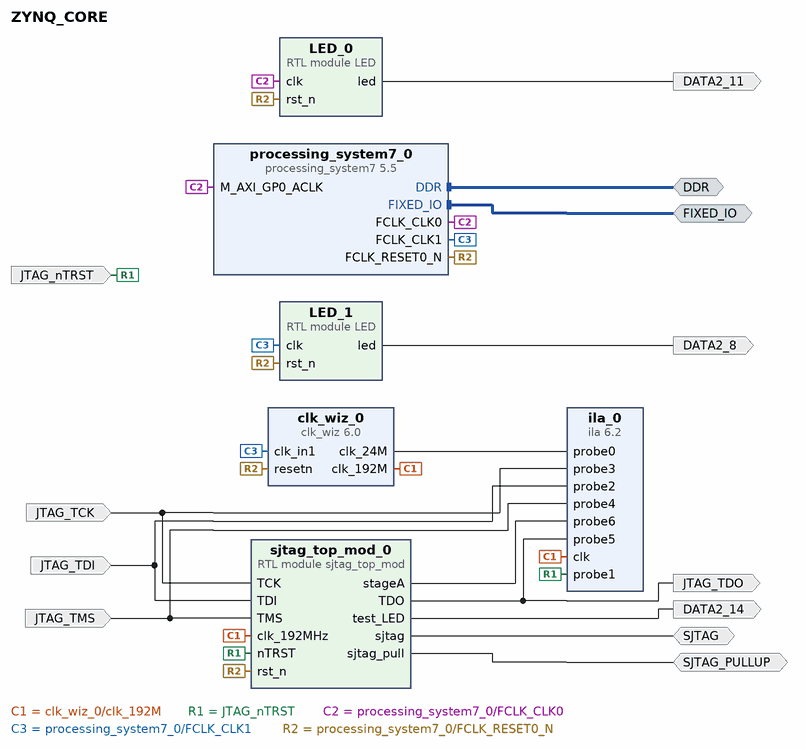
[diagram p0: block diagram of the top level]
# Vivado block design ZYNQ_CORE, xc7z010clg400-1, Vivado 2021.2
create_bd_design ZYNQ_CORE

create_bd_intf_port -mode Master -vlnv xilinx.com:interface:ddrx_rtl:1.0 DDR
create_bd_intf_port -mode Master -vlnv xilinx.com:display_processing_system7:fixedio_rtl:1.0 FIXED_IO
create_bd_port -dir I JTAG_nTRST
create_bd_port -dir I JTAG_TDI
create_bd_port -dir I JTAG_TCK
create_bd_port -dir I JTAG_TMS
create_bd_port -dir O JTAG_TDO
create_bd_port -dir O DATA2_8
create_bd_port -dir O DATA2_11
create_bd_port -dir O DATA2_14
create_bd_port -dir IO SJTAG
create_bd_port -dir IO SJTAG_PULLUP

create_bd_cell -type ip -vlnv xilinx.com:ip:processing_system7:5.5 processing_system7_0
set_property -dict [list \
  CONFIG.PCW_EN_CLK1_PORT 1 \
  CONFIG.PCW_FCLK_CLK1_BUF TRUE \
  CONFIG.PCW_FPGA0_PERIPHERAL_FREQMHZ 50 \
  CONFIG.PCW_FPGA1_PERIPHERAL_FREQMHZ 48 \
  CONFIG.PCW_FPGA_FCLK1_ENABLE 1 \
  CONFIG.PCW_SD0_GRP_CD_ENABLE 1 \
  CONFIG.PCW_SD0_GRP_CD_IO {MIO 34} \
  CONFIG.PCW_SD0_GRP_WP_ENABLE 0 \
  CONFIG.PCW_SD0_PERIPHERAL_ENABLE 1 \
  CONFIG.PCW_SD0_SD0_IO {MIO 40 .. 45} \
  CONFIG.PCW_SDIO_PERIPHERAL_FREQMHZ 100 \
  CONFIG.PCW_UART1_PERIPHERAL_ENABLE 1 \
  CONFIG.PCW_UART1_UART1_IO {MIO 24 .. 25} \
  CONFIG.PCW_UART_PERIPHERAL_FREQMHZ 100 \
  CONFIG.PCW_UIPARAM_DDR_BUS_WIDTH {16 Bit} \
  CONFIG.PCW_UIPARAM_DDR_PARTNO {MT41K128M16 JT-125} \
] [get_bd_cells processing_system7_0]
# 70 more settings of processing_system7_0 are not shown: defaults, MIO pin electricals, DDR timing, and values the tool derives
create_bd_cell -type ip -vlnv xilinx.com:ip:clk_wiz:6.0 clk_wiz_0
set_property -dict [list \
  CONFIG.CLKIN1_JITTER_PS 208.32999999999998 \
  CONFIG.CLKOUT1_DRIVES BUFG \
  CONFIG.CLKOUT1_JITTER 149.761 \
  CONFIG.CLKOUT1_PHASE_ERROR 172.145 \
  CONFIG.CLKOUT1_REQUESTED_OUT_FREQ 192.000 \
  CONFIG.CLKOUT2_DRIVES BUFG \
  CONFIG.CLKOUT2_JITTER 251.079 \
  CONFIG.CLKOUT2_PHASE_ERROR 172.145 \
  CONFIG.CLKOUT2_REQUESTED_OUT_FREQ 24 \
  CONFIG.CLKOUT2_USED true \
  CONFIG.CLKOUT3_DRIVES BUFG \
  CONFIG.CLKOUT4_DRIVES BUFG \
  CONFIG.CLKOUT5_DRIVES BUFG \
  CONFIG.CLKOUT6_DRIVES BUFG \
  CONFIG.CLKOUT7_DRIVES BUFG \
  CONFIG.CLK_OUT1_PORT clk_192M \
  CONFIG.CLK_OUT2_PORT clk_24M \
  CONFIG.ENABLE_CLOCK_MONITOR false \
  CONFIG.FEEDBACK_SOURCE FDBK_AUTO \
  CONFIG.MMCM_BANDWIDTH OPTIMIZED \
  CONFIG.MMCM_CLKFBOUT_MULT_F 20 \
  CONFIG.MMCM_CLKIN1_PERIOD 20.833 \
  CONFIG.MMCM_CLKIN2_PERIOD 10.0 \
  CONFIG.MMCM_CLKOUT0_DIVIDE_F 5 \
  CONFIG.MMCM_CLKOUT1_DIVIDE 40 \
  CONFIG.MMCM_COMPENSATION ZHOLD \
  CONFIG.MMCM_DIVCLK_DIVIDE 1 \
  CONFIG.NUM_OUT_CLKS 2 \
  CONFIG.PLL_CLKIN_PERIOD 20.833 \
  CONFIG.PRIMITIVE PLL \
  CONFIG.PRIM_SOURCE Global_buffer \
  CONFIG.RESET_PORT resetn \
  CONFIG.RESET_TYPE ACTIVE_LOW \
  CONFIG.USE_LOCKED false \
  CONFIG.USE_POWER_DOWN false \
  CONFIG.USE_RESET true \
] [get_bd_cells clk_wiz_0]
create_bd_cell -type ip -vlnv xilinx.com:ip:ila:6.2 ila_0
set_property -dict [list \
  CONFIG.ALL_PROBE_SAME_MU true \
  CONFIG.ALL_PROBE_SAME_MU_CNT 2 \
  CONFIG.C_ADV_TRIGGER false \
  CONFIG.C_DATA_DEPTH 8192 \
  CONFIG.C_ENABLE_ILA_AXI_MON false \
  CONFIG.C_EN_STRG_QUAL 0 \
  CONFIG.C_MONITOR_TYPE Native \
  CONFIG.C_NUM_OF_PROBES 7 \
  CONFIG.C_PROBE0_MU_CNT 2 \
  CONFIG.C_PROBE1_MU_CNT 2 \
  CONFIG.C_PROBE2_MU_CNT 2 \
  CONFIG.C_PROBE3_MU_CNT 2 \
  CONFIG.C_PROBE4_MU_CNT 2 \
  CONFIG.C_PROBE5_MU_CNT 2 \
  CONFIG.C_PROBE6_MU_CNT 2 \
  CONFIG.C_PROBE6_WIDTH 8 \
  CONFIG.C_PROBE7_MU_CNT 2 \
  CONFIG.C_TRIGIN_EN false \
  CONFIG.C_TRIGOUT_EN false \
] [get_bd_cells ila_0]
create_bd_cell -type module -reference LED LED_0
create_bd_cell -type module -reference LED LED_1
create_bd_cell -type module -reference sjtag_top_mod sjtag_top_mod_0

# ---- connections ----

connect_bd_intf_net [get_bd_intf_ports DDR] [get_bd_intf_pins processing_system7_0/DDR]
connect_bd_intf_net [get_bd_intf_ports FIXED_IO] [get_bd_intf_pins processing_system7_0/FIXED_IO]
connect_bd_net [get_bd_pins LED_0/led] [get_bd_ports DATA2_11]
connect_bd_net [get_bd_pins LED_1/led] [get_bd_ports DATA2_8]
connect_bd_net [get_bd_ports SJTAG] [get_bd_pins sjtag_top_mod_0/sjtag]
connect_bd_net [get_bd_ports SJTAG_PULLUP] [get_bd_pins sjtag_top_mod_0/sjtag_pull]
connect_bd_net -net TCK_0_1 [get_bd_ports JTAG_TCK] [get_bd_pins ila_0/probe3] [get_bd_pins sjtag_top_mod_0/TCK]
connect_bd_net -net TDI_0_1 [get_bd_ports JTAG_TDI] [get_bd_pins ila_0/probe2] [get_bd_pins sjtag_top_mod_0/TDI]
connect_bd_net -net TMS_0_1 [get_bd_ports JTAG_TMS] [get_bd_pins ila_0/probe4] [get_bd_pins sjtag_top_mod_0/TMS]
connect_bd_net [get_bd_pins clk_wiz_0/clk_24M] [get_bd_pins ila_0/probe0]
connect_bd_net -net clk_wiz_0_clk_out1 [get_bd_pins clk_wiz_0/clk_192M] [get_bd_pins ila_0/clk] [get_bd_pins sjtag_top_mod_0/clk_192MHz]
connect_bd_net -net nTRST_0_1 [get_bd_ports JTAG_nTRST] [get_bd_pins ila_0/probe1] [get_bd_pins sjtag_top_mod_0/nTRST]
connect_bd_net [get_bd_pins processing_system7_0/FCLK_CLK0] [get_bd_pins processing_system7_0/M_AXI_GP0_ACLK] [get_bd_pins LED_0/clk]
connect_bd_net [get_bd_pins processing_system7_0/FCLK_CLK1] [get_bd_pins LED_1/clk] [get_bd_pins clk_wiz_0/clk_in1]
connect_bd_net [get_bd_pins processing_system7_0/FCLK_RESET0_N] \
  [get_bd_pins clk_wiz_0/resetn] [get_bd_pins LED_0/rst_n] [get_bd_pins LED_1/rst_n] [get_bd_pins sjtag_top_mod_0/rst_n]
connect_bd_net [get_bd_pins sjtag_top_mod_0/TDO] [get_bd_ports JTAG_TDO] [get_bd_pins ila_0/probe5]
connect_bd_net [get_bd_pins sjtag_top_mod_0/stageA] [get_bd_pins ila_0/probe6]
connect_bd_net [get_bd_pins sjtag_top_mod_0/test_LED] [get_bd_ports DATA2_14]

validate_bd_design
save_bd_design
